# EAGLE design 5_Way_Selector_Switch (EAGLE 6.3)

## Sheet 1 of 2
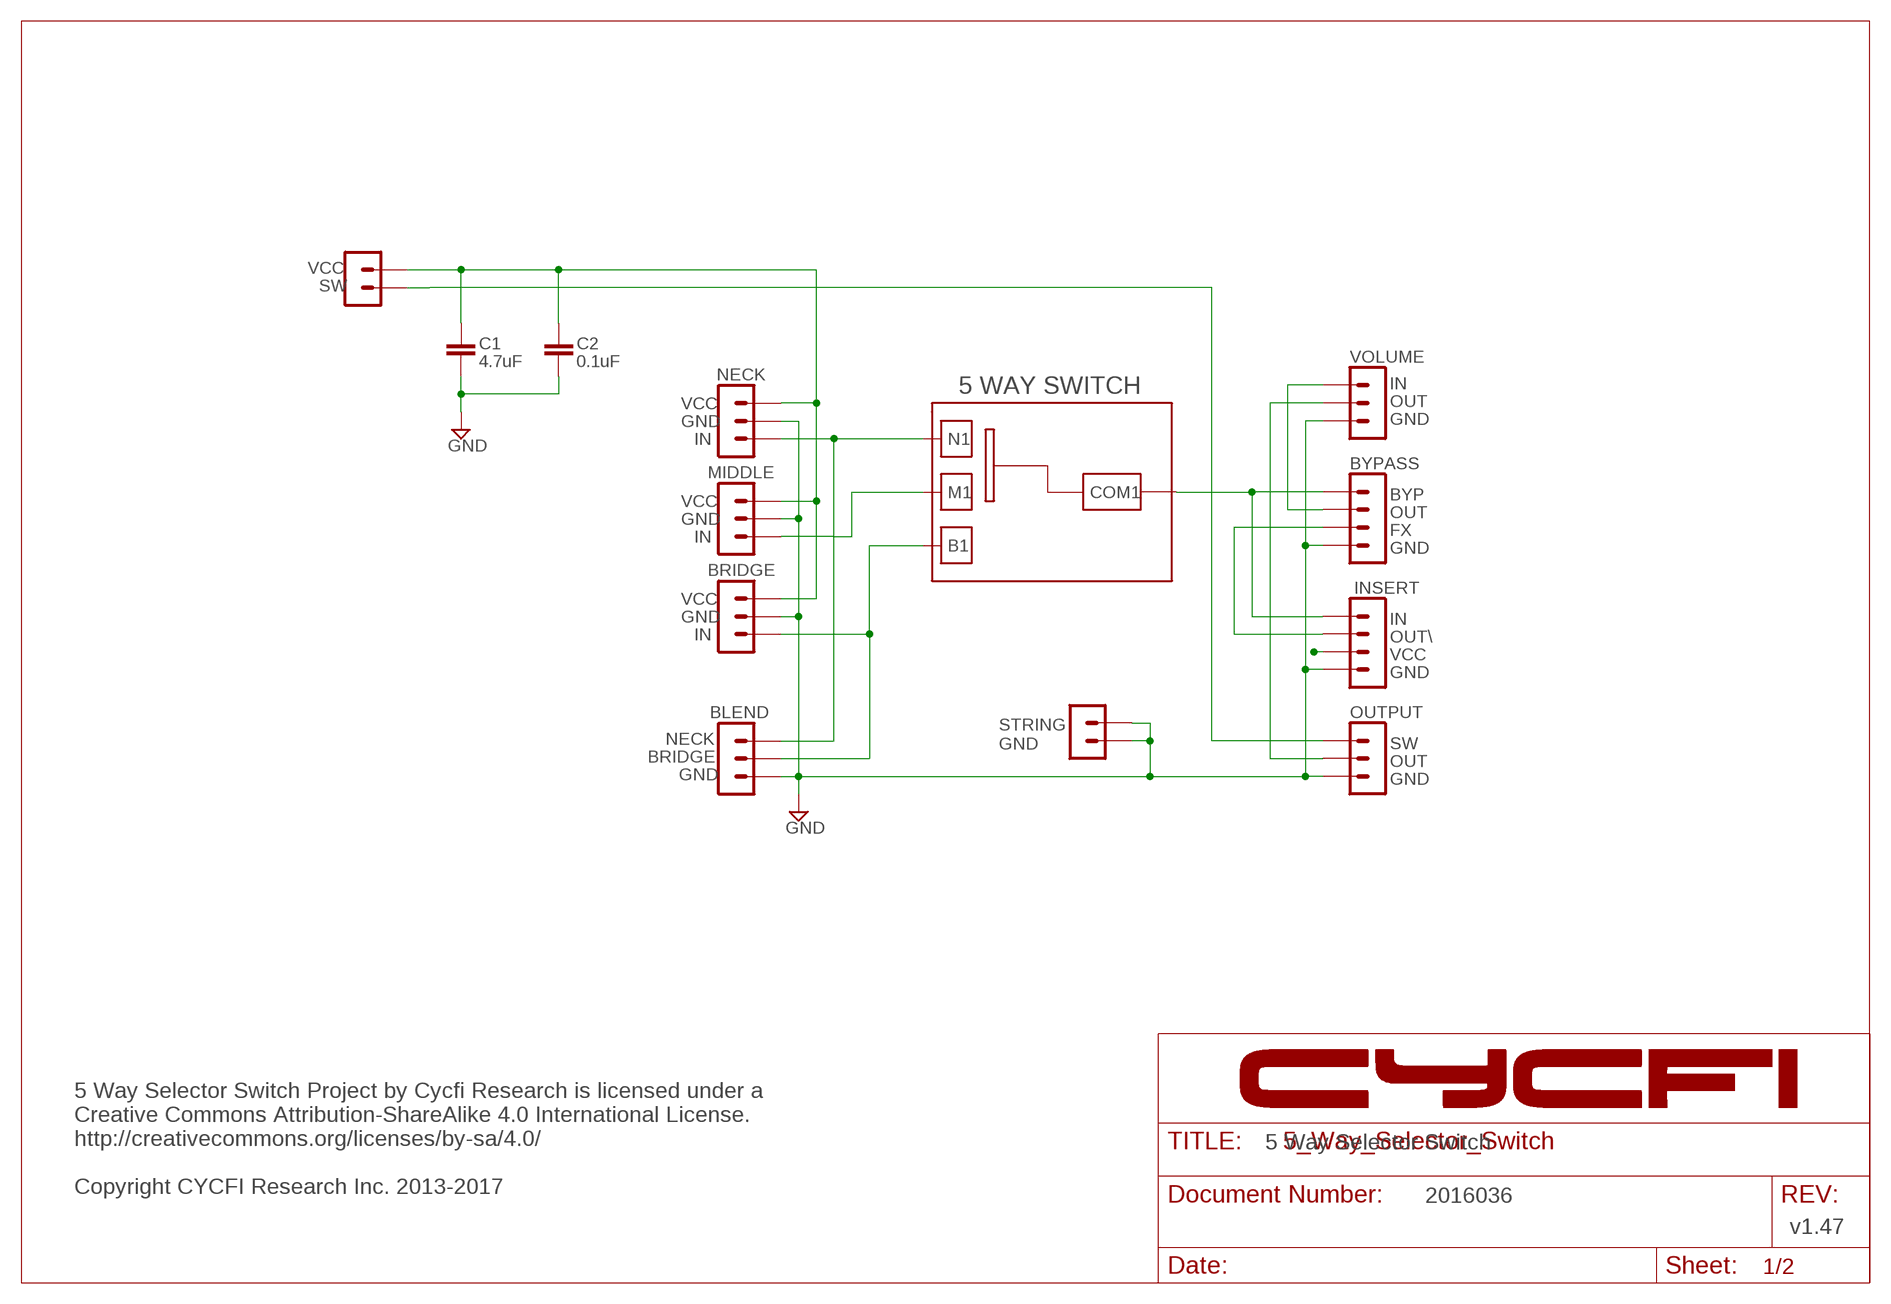
[diagram p0: schematic, sheet 1]

### Parts
C1  4.7uF  C-EUC0603  [C0603]
C2  0.1uF  C-EUC0603  [C0603]
H3  2PIN-SMD-2.54MM  [2P-SMD-2.54MM]
U$3  5WAY_SW_1  [5WAY_SW_CASTELLATED]

### Nets
5WOUT: U$3.COM1 ; also sheet 2
9V: C1.1 C2.1 ; also sheet 2
B1: U$3.B1 ; also sheet 2
GND: C1.2 C2.2 H3.P$1 H3.P$2 ; also sheet 2
M1: U$3.M1 ; also sheet 2
N1: U$3.N1 ; also sheet 2

### Notes on the sheet
- VCC
- SW
- VOLUME
- NECK
- IN
- VCC | OUT
- GND | GND
- IN
- BYPASS
- MIDDLE
- BYP
- VCC
- OUT
- GND
- FX
- IN
- GND
- BRIDGE
- INSERT
- VCC
- GND | IN
- IN | OUT\
- VCC
- GND
- BLEND | OUTPUT
- NECK
- STRING 
  GND
- SW
- BRIDGE | OUT
- GND | GND
- 5 Way Selector Switch
- 5 Way Selector Switch Project by Cycfi Research is licensed under a 
  Creative Commons Attribution-ShareAlike 4.0 International License. 
  http://creativecommons.org/licenses/by-sa/4.0/
  
  Copyright CYCFI Research Inc. 2013-2017
- 2016036
- v1.47

## Sheet 2 of 2
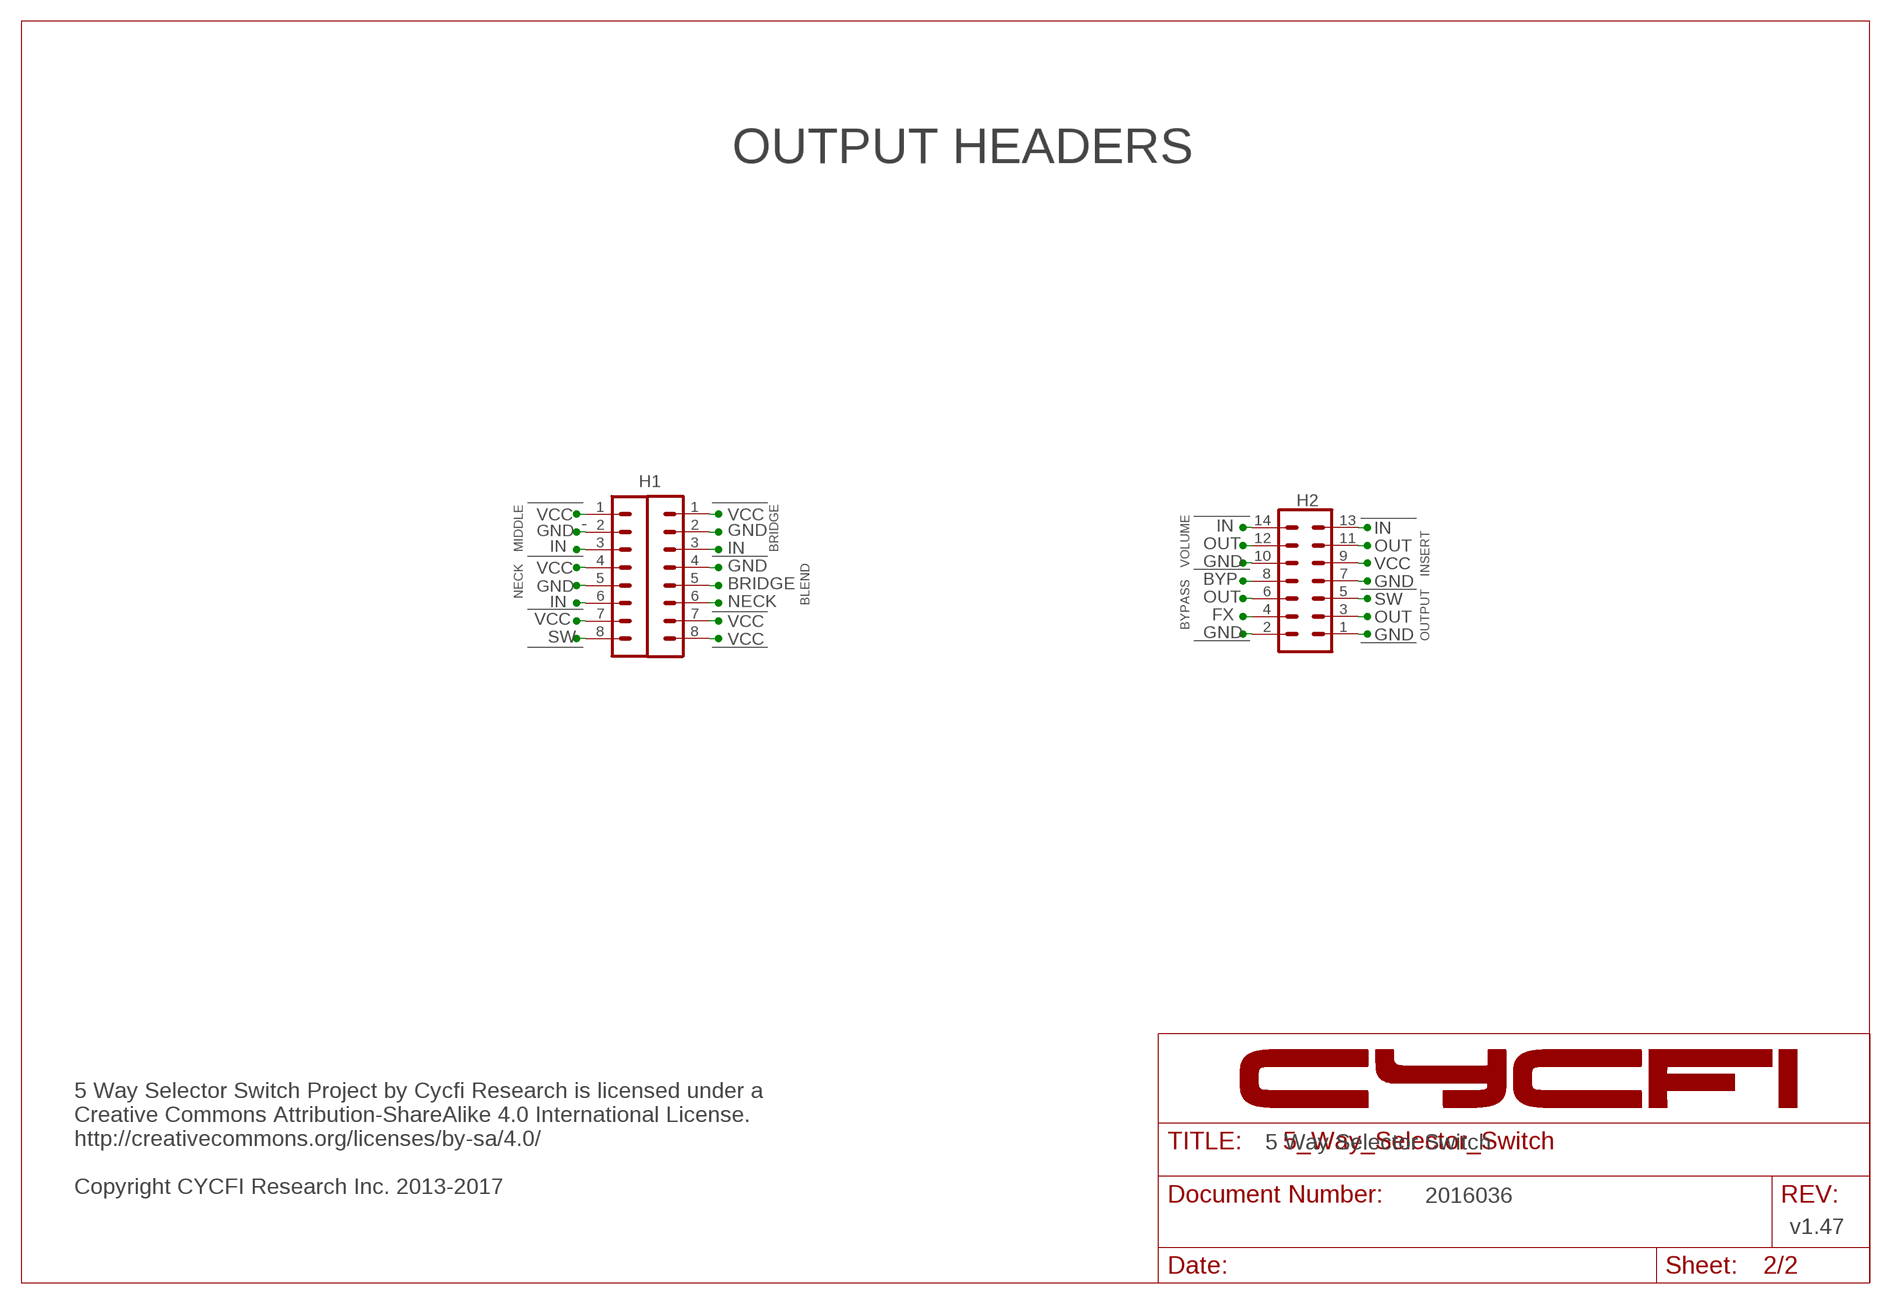
[diagram p1: schematic, sheet 2]

### Parts
H2  MA07-2  [MA07-2]
SV1  MA08-1_  [MA08-1_]
SV2  MA08-1_  [MA08-1_]

### Nets
5WOUT: H2.8 H2.13 ; also sheet 1
9V: H2.9 SV1.1 SV1.7 SV1.8 SV2.1 SV2.4 SV2.7 ; also sheet 1
B1: SV1.3 SV1.5 ; also sheet 1
FX: H2.4 H2.11 ; also sheet 1
GND: H2.1 H2.2 H2.7 H2.10 SV1.2 SV1.4 SV2.2 SV2.5 ; also sheet 1
IN_VOL/MAIN_OUT: H2.6 H2.14 ; also sheet 1
M1: SV2.3 ; also sheet 1
N1: SV1.6 SV2.6 ; also sheet 1
OUT(VOL): H2.3 H2.12 ; also sheet 1
SW: H2.5 SV2.8 ; also sheet 1

### Notes on the sheet
- OUTPUT HEADERS
- H1
- VCC | VCC
- - | IN | IN
- GND | GND
- MIDDLE | IN | IN | BRIDGE | OUT | OUT
- VOLUME | GND | VCC
- VCC | GND
- INSERT
- BRIDGE | BYP | GND
- GND
- NECK
- IN | NECK | BLEND | OUT | SW
- VCC | FX | OUT
- VCC | BYPASS
- SW | GND | GND | OUTPUT
- VCC
- 5 Way Selector Switch
- 5 Way Selector Switch Project by Cycfi Research is licensed under a 
  Creative Commons Attribution-ShareAlike 4.0 International License. 
  http://creativecommons.org/licenses/by-sa/4.0/
  
  Copyright CYCFI Research Inc. 2013-2017
- 2016036
- v1.47

## Library data of the parts
C1 C2 = resistor:C-EU: CAPACITOR, European symbol
H2 = con-lstb:MA07-2: PIN HEADER; OC_FARNELL: unknown; OC_NEWARK: unknown
H3 = CYCFI_Con:2PIN-SMD-2.54MM
SV1 SV2 = con-lstb:MA08-1: PIN HEADER
U$3 = CYCFI_switch:5WAY_SW_1

## Board
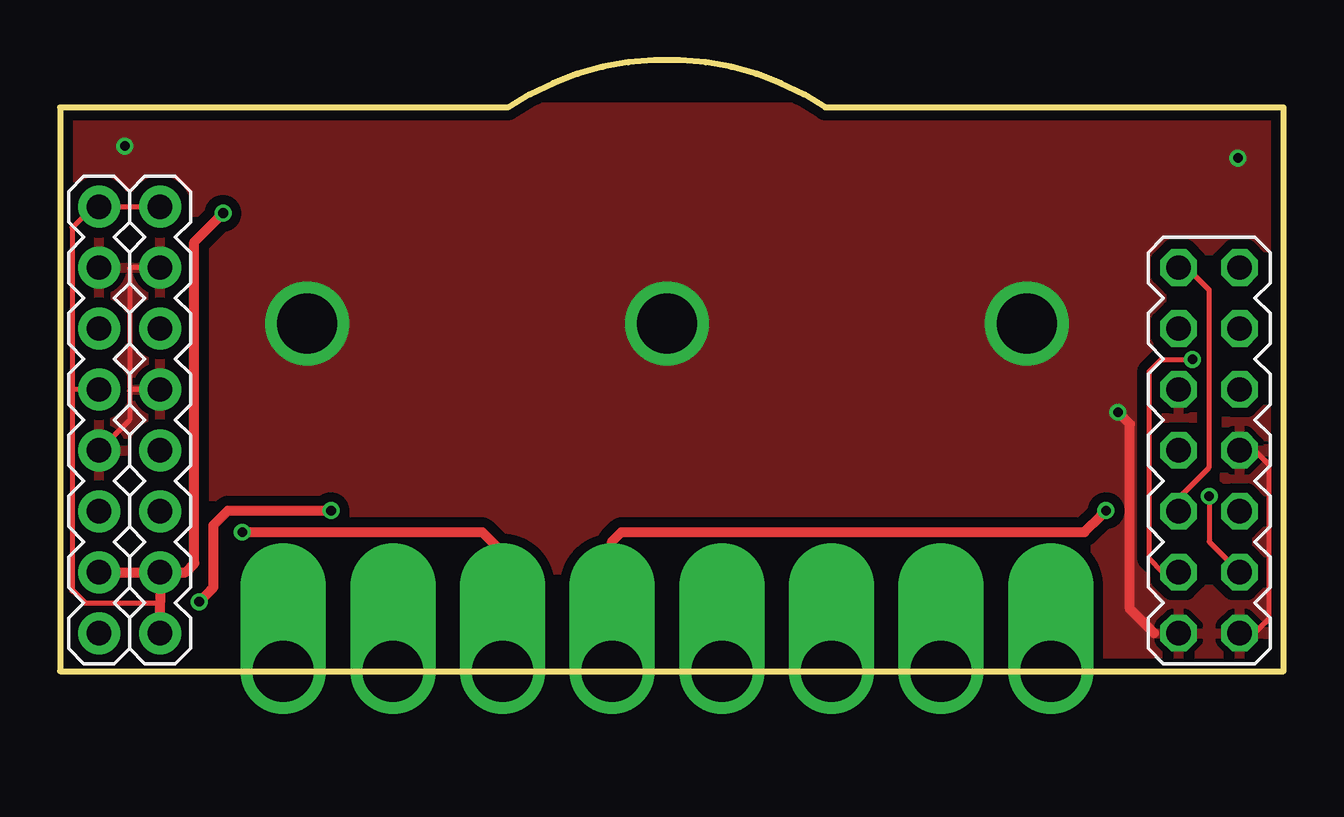
[diagram p2: board, top side]
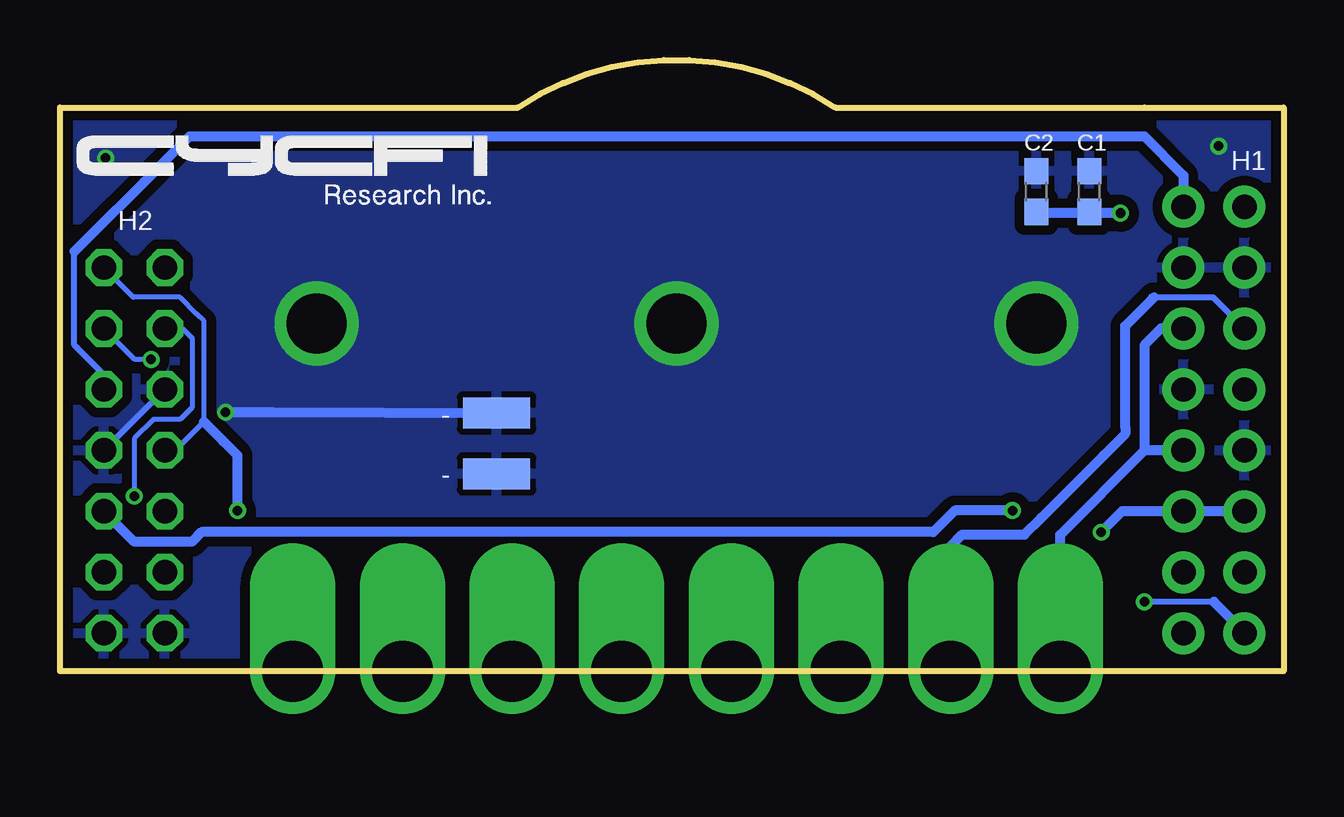
[diagram p3: board, bottom side, seen from below]

Size 51 x 25.49 mm. Coordinates in mm from the lower left corner, seen from the top.
Outline: 5.8,23.5 18.67,23.5 arc-67 31.93,23.5 44.8,23.5
Outline: 31.9,23.5 51,23.5 51,0 0,0 0,23.5 5.8,23.5
Copper layers (1*16): Top 0.035mm / dielectric 1.5mm / Bottom 0.035mm
Design rules "SeeedStudio_2layer_DRU_no_angle_20140221": minimum track width 6mil, minimum drill 12mil, track to track 6mil, track to pad 6mil, pad to pad 6mil, via to via 6mil, smd to smd 0mil, copper to edge 10mil, drill to drill 10mil, minimum pad ring 10mil, minimum via ring 6mil, stop-mask expansion 2mil, vias tented up to drill 100mil, thermal gap 10mil

### Footprints (pad centres in the part's own frame; a part is rotated, then mirrored left to right if it is on the bottom)
C0603 = smd 1.1 x 1: 1 -0.85,0; 2 0.85,0
MA07-2 = drill 1.016 octagon: 1 -7.62,-1.27; 2 -7.62,1.27; 3 -5.08,-1.27; 4 -5.08,1.27; 5 -2.54,-1.27; 6 -2.54,1.27; 7 0,-1.27; 8 0,1.27; 9 2.54,-1.27; 10 2.54,1.27; 11 5.08,-1.27; 12 5.08,1.27; 13 7.62,-1.27; 14 7.62,1.27
2P-SMD-2.54MM = smd 1.3 x 2.8: P$1 -1.27,0; P$2 1.27,0
MA08-1_ = drill 1.016 pad 1.75: 1 -8.89,0; 2 -6.35,0; 3 -3.81,0; 4 -1.27,0; 5 1.27,0; 6 3.81,0; 7 6.35,0; 8 8.89,0
5WAY_SW_CASTELLATED = drill 2.54 offset: B1 -15.995,0; B2 6.855,0; COM1 -2.285,0; COM2 2.285,0; M1 -11.425,0; M2 11.425,0; N1 -6.855,0; N2 15.995,0

### Placement (x,y rotation side)
C1  8.1,20 90 bottom
C2  10.3,20 90 bottom
H2  47.9,9.21 90 top
H3  32.8,9.5 270 bottom
SV1  4.17,10.48 270 top
SV2  1.63,10.48 270 top
U$3  25.3,0 0 top

### Tracks (layer width: path | path; a pad name or v marks a point on that pad's centre or on a via)
5WOUT  (via drill 0.4)
  Top 0.406: U$3.COM1 23.02,5.42 23.4,5.8 42.6,5.8 42.7,5.8 43.4,6.5 v43.6,6.7
  Bottom 0.203: H2.8 46.19,9.21 45.3,10.1 45.1,10.3 45,10.4 45,14.6 45.3,14.9 46,15.6 47.94,15.6 H2.13
  Bottom 0.406: 45,10.4 44.2,9.6 43.6,9 v43.6,6.7
9V  (via drill 0.4)
  Top 0.203: 0.5,11.75 0.5,17 0.5,18.5 1.37,19.37 SV2.1 SV1.1 | 0.5,11.75 0.5,3.35 0.55,3.35 1,2.9 1.05,2.85 4.15,2.85 | SV2.4 0.5,11.75
  Top 0.406: v6.8,19.1 6.4,18.7 5.6,17.9 5.6,4.5 5.23,4.13 SV1.7 | SV1.7 4.17,2.87 4.15,2.85 4.15,1.61 SV1.8 | SV2.7 SV1.7
  Bottom 0.203: C1.1 8.15,19.15 8.2,19.1
  Bottom 0.254: H2.9 49.17,12.37 50.3,13.5 50.4,13.6 50.4,17.5
  Bottom 0.406: 50.4,17.5 49.7,18.2 47.5,20.4 46.6,21.3 45.9,22 45.6,22.3 5.8,22.3 4.17,20.67 SV1.1 | v6.8,19.1 8.05,19.1 8.2,19.1 10.3,19.1 C2.1
B1
  Bottom 0.203: SV1.5
  Bottom 0.406: 5.8,9.2 5.8,13.6 5.11,14.29 SV1.3 | U$3.B1 9.3,5.7 5.8,9.2 | SV1.5 5.8,9.2
FX  (via drill 0.4)
  Top 0.203: v47.2,13 45.9,13 45.4,12.5 45.4,4.7 45.97,4.13 H2.4
  Bottom 0.203: v47.2,13 47.88,13 H2.11
GND  (via drill 0.4, 2.5)
  Top 0.203: H2.1 49.79,1.59 50.4,2.2 50.4,8.6 49.8,9.2 H2.7 | SV1.2 2.93,16.83 2.9,16.8 2.9,11.7 | 2.9,11.7 2.9,10.48 SV2.5 | SV1.4 2.95,11.75 2.9,11.7
  Top 0.406: 45.61,1.59 44.8,2.4 44.6,2.6 44.6,10.3 v44.1,10.8
  Bottom 0.254: H2.10 H2.7
  Bottom 0.406: v44.1,10.8 42.13,10.8 H3.P$1
  other vias: 10.3,14.5 25.3,14.5 40.3,14.5 49.1,21.4 2.7,21.9
  pour Top (isolate 0.406): 0,0 51,0 51,23.5 0,23.5
  pour Bottom (isolate 0.406): 0,23.5 51,23.5 51,0 0,0
IN_VOL/MAIN_OUT
  Top 0.203: H2.6 46.63,7.23 47.9,8.5 47.9,15.9 46.97,16.83 H2.14
M1
  Bottom 0.254: 5.4,15.6 2.94,15.6 SV2.3
  Bottom 0.406: U$3.M1 13.88,5.22 13.4,5.7 10.8,5.7 10.1,6.4 7.5,9 6.6,9.9 6.6,10.2 6.6,14.4 5.5,15.5 5.4,15.6
N1  (via drill 0.4)
  Top 0.406: U$3.N1 18.5,0.06 18.5,4.9 17.6,5.8 v7.6,5.8
  Bottom 0.406: v7.6,5.8 6.73,6.67 SV1.6 SV2.6
OUT(VOL)  (via drill 0.4)
  Top 0.203: v47.9,7.3 47.9,5.4 H2.3
  Bottom 0.203: v47.9,7.3 47.9,9.7 47.1,10.5 46,10.5 45.5,11 45.5,13.9 45.89,14.29 H2.12
SW  (via drill 0.4)
  Top 0.406: v5.8,2.9 6.3,3.4 6.4,3.5 6.4,6.1 7,6.7 v11.3,6.7
  Bottom 0.254: 2.9,2.9 v5.8,2.9
  Bottom 0.406: SV2.8 1.63,1.63 2.9,2.9 | v11.3,6.7 13.7,6.7 14.6,5.8 45.1,5.8 45.5,5.4 47.9,5.4 H2.5

### Text on the board
bNames: - | -
_bNames: C1 | C2 | H1 | H2 | - | -